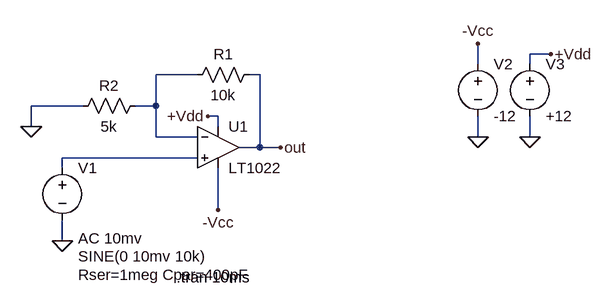
[diagram p0: schematic Draft5.asc]
Draft5.asc, the LTspice schematic file:
Version 4
SHEET 1 880 680
WIRE 752 -32 720 -32
WIRE 640 -16 640 -48
WIRE 720 -16 720 -32
WIRE 208 0 144 0
WIRE 304 0 288 0
WIRE 32 48 -48 48
WIRE 144 48 144 0
WIRE 144 48 112 48
WIRE 240 64 224 64
WIRE -48 80 -48 48
WIRE 240 80 240 64
WIRE 144 96 144 48
WIRE 208 96 144 96
WIRE 640 96 640 64
WIRE 720 96 720 64
WIRE 304 112 304 0
WIRE 304 112 272 112
WIRE 336 112 304 112
WIRE 208 128 0 128
WIRE 0 144 0 128
WIRE 240 208 240 144
WIRE 0 256 0 224
FLAG 0 256 0
FLAG 640 96 0
FLAG 720 96 0
FLAG 224 64 +Vdd
FLAG 752 -32 +Vdd
FLAG 640 -48 -Vcc
FLAG 240 208 -Vcc
FLAG 336 112 out
FLAG -48 80 0
SYMBOL voltage 0 128 R0
WINDOW 3 24 152 Left 2
WINDOW 123 24 124 Left 2
WINDOW 39 24 180 Left 2
SYMATTR InstName V1
SYMATTR Value SINE(0 10mv 10k)
SYMATTR Value2 AC 10mv
SYMATTR SpiceLine Rser=1meg Cpar=400pF
SYMBOL Opamps\\LT1022 240 48 R0
SYMATTR InstName U1
SYMBOL voltage 640 -32 R0
WINDOW 123 0 0 Left 2
WINDOW 39 0 0 Left 2
SYMATTR InstName V2
SYMATTR Value -12
SYMBOL voltage 720 -32 R0
WINDOW 123 0 0 Left 2
WINDOW 39 0 0 Left 2
SYMATTR InstName V3
SYMATTR Value +12
SYMBOL res 192 16 R270
WINDOW 0 32 56 VTop 2
WINDOW 3 0 56 VBottom 2
SYMATTR InstName R1
SYMATTR Value 10k
SYMBOL res 128 32 R90
WINDOW 0 0 56 VBottom 2
WINDOW 3 32 56 VTop 2
SYMATTR InstName R2
SYMATTR Value 5k
TEXT 176 312 Left 2 !.tran 10ms

The netlist it stands for:
* Draft5.asc
V1 N002 0 SINE(0 10mv 10k) AC 10mv Rser=1meg Cpar=400pF
XU1 N002 N001 +Vdd -Vcc out LT1022  ; pins In+ In- V+ V- OUT
V2 -Vcc 0 -12
V3 +Vdd 0 +12
R1 N001 out 10k
R2 N001 0 5k
.tran 10ms
.backanno
.end